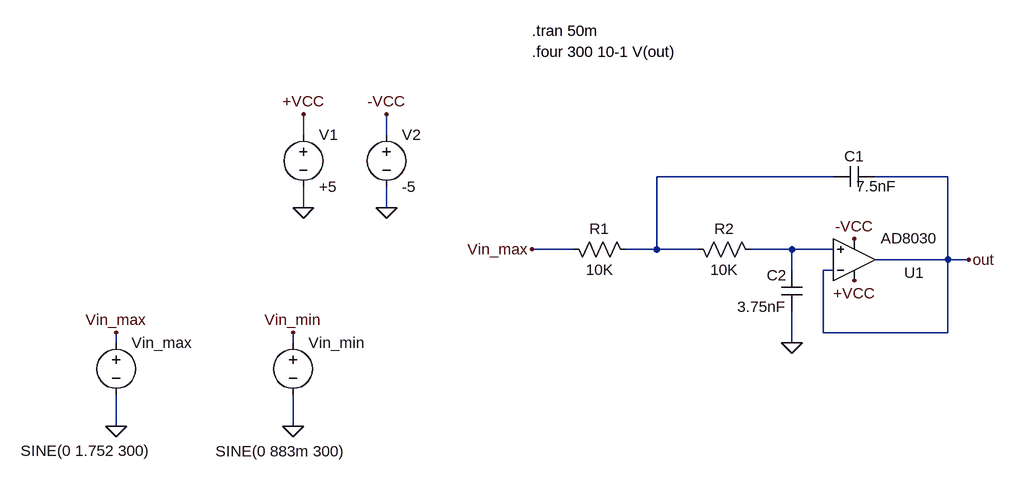
[diagram p0: schematic FTJ THD.asc]
FTJ THD.asc, the LTspice schematic file:
Version 4.1
SHEET 1 880 680
WIRE -592 -48 -592 -80
WIRE -464 -48 -464 -80
WIRE 224 16 -48 16
WIRE 400 16 288 16
WIRE -592 64 -592 32
WIRE -464 64 -464 32
WIRE -176 128 -240 128
WIRE -48 128 -48 16
WIRE -48 128 -96 128
WIRE 16 128 -48 128
WIRE 160 128 96 128
WIRE 224 128 160 128
WIRE 400 144 400 16
WIRE 400 144 288 144
WIRE 432 144 400 144
WIRE 160 160 160 128
WIRE 224 160 208 160
WIRE 208 256 208 160
WIRE 400 256 400 144
WIRE 400 256 208 256
WIRE -880 272 -880 256
WIRE -608 272 -608 256
WIRE 160 272 160 224
WIRE -880 400 -880 352
WIRE -608 400 -608 352
FLAG 160 272 0
FLAG 432 144 out
FLAG -592 64 0
FLAG -464 64 0
FLAG -464 -80 -VCC
FLAG 256 112 -VCC
FLAG -592 -80 +VCC
FLAG 256 176 +VCC
FLAG -880 400 0
FLAG -608 400 0
FLAG -608 256 Vin_min
FLAG -880 256 Vin_max
FLAG -240 128 Vin_max
SYMBOL OpAmps\\AD8030 256 208 M180
WINDOW 0 77 44 Left 2
WINDOW 3 41 97 Left 2
SYMATTR InstName U1
SYMBOL res -192 112 M90
WINDOW 0 0 56 VBottom 2
WINDOW 3 32 56 VTop 2
SYMATTR InstName R1
SYMATTR Value 10K
SYMBOL res 0 112 M90
WINDOW 0 0 56 VBottom 2
WINDOW 3 32 56 VTop 2
SYMATTR InstName R2
SYMATTR Value 10K
SYMBOL cap 288 0 R90
WINDOW 0 0 32 VBottom 2
WINDOW 3 15 -2 VTop 2
SYMATTR InstName C1
SYMATTR Value 7.5nF
SYMBOL cap 176 224 R180
WINDOW 0 24 56 Left 2
WINDOW 3 24 8 Left 2
SYMATTR InstName C2
SYMATTR Value 3.75nF
SYMBOL voltage -592 -64 R0
WINDOW 123 0 0 Left 0
WINDOW 39 0 0 Left 0
SYMATTR InstName V1
SYMATTR Value +5
SYMBOL voltage -464 -64 R0
WINDOW 123 0 0 Left 0
WINDOW 39 0 0 Left 0
SYMATTR InstName V2
SYMATTR Value -5
SYMBOL voltage -880 256 R0
WINDOW 3 -147 182 Left 2
WINDOW 123 49 93 Left 2
WINDOW 39 0 0 Left 0
SYMATTR Value SINE(0 1.752 300)
SYMATTR InstName Vin_max
SYMBOL voltage -608 256 R0
WINDOW 3 -119 183 Left 2
WINDOW 123 49 93 Left 2
WINDOW 39 0 0 Left 0
SYMATTR Value SINE(0 883m 300)
SYMATTR InstName Vin_min
TEXT -240 -208 Left 2 !.tran 50m
TEXT -240 -176 Left 2 !.four 300 10-1 V(out)

The netlist it stands for:
* FTJ THD.asc
X§U1 N002 out +VCC -VCC out AD8040  ; AD8030, pins In+ In- V+ V- OUT
R1 Vin_max N001 10K
R2 N001 N002 10K
C1 out N001 7.5nF
C2 0 N002 3.75nF
V1 +VCC 0 +5
V2 -VCC 0 -5
Vin_max Vin_max 0 SINE(0 1.752 300)
Vin_min Vin_min 0 SINE(0 883m 300)
.tran 50m
.four 300 10-1 V(out)
.lib ADI.lib
.backanno
.end